# Altium schematic sheet Controller_Board.SchDoc: Controller Board - Power & CAN
size B; PageSetup: Record=PageOptions|CenterHorizontal=True|CenterVertical=True|PrintScale=0.64|XCorrection=1.00|YCorrection=1.00|PrintKind=1|BorderSize=5000000|LeftOffset=0|BottomOffset=0|Orientation=2|PaperLength=1000|PaperWidth=1000|Scale=100|PaperSource=7|PrintQuality=-3|MediaType=1|DitherType=10|PrintScaleMode=1|PaperKind=Letter|PaperIndex=1; Organization: Midnight Sun Solar Rayce Car Team; Address1: University of Waterloo; Address2: 200 University Ave W; Address3: Waterloo, ON, Canada; Address4: N2L 3E9; DocumentNumber: 3; SheetNumber: 3; SheetTotal: 3; Website: www.uwmidsun.com; ProjectName: ProjectName
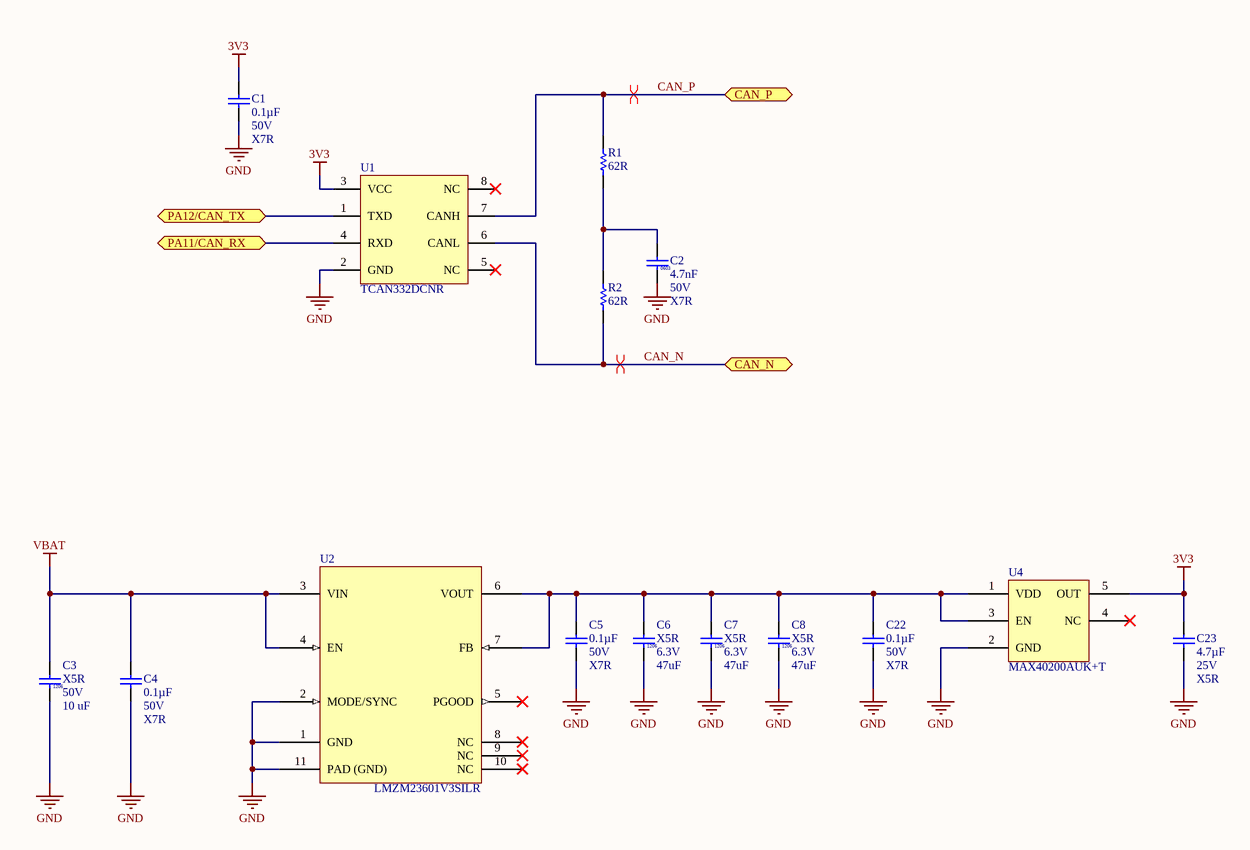
[diagram p0: Controller_Board.SchDoc]

## Parts
C1  Capacitance: 0.1µF  Voltage: 50V  Temperature Coefficient: X7R  [CAP, 0603]  (hidden comment: CAP CER 0.1UF 50V 10% X7R 0603)
C2  Capacitance: 4.7nF  Voltage: 50V  Dielectric: X7R  [CAP, 0603]  (hidden comment: CAP CER 4.7nF 50V 10% X7R 0603)
C3  Rating: X5R  Voltage Rating: 50V  Capacitance: 10 uF  [CAP, 1206]  (hidden comment: CAP CER 10uF 50V 20% X5R 1206)
C4  Capacitance: 0.1µF  Voltage: 50V  Temperature Coefficient: X7R  [CAP, 0603]  (hidden comment: CAP CER 0.1UF 50V 10% X7R 0603)
C5  Capacitance: 0.1µF  Voltage: 50V  Temperature Coefficient: X7R  [CAP, 0603]  (hidden comment: CAP CER 0.1UF 50V 10% X7R 0603)
C6  Dielectric: X5R  Voltage: 6.3V  Capacitance: 47uF  [CAP, 1206]  (hidden comment: CAP CER 47uF 6.3V X5R 1206)
C7  Dielectric: X5R  Voltage: 6.3V  Capacitance: 47uF  [CAP, 1206]  (hidden comment: CAP CER 47uF 6.3V X5R 1206)
C8  Dielectric: X5R  Voltage: 6.3V  Capacitance: 47uF  [CAP, 1206]  (hidden comment: CAP CER 47uF 6.3V X5R 1206)
C22  Capacitance: 0.1µF  Voltage: 50V  Temperature Coefficient: X7R  [CAP, 0603]  (hidden comment: CAP CER 0.1UF 50V 10% X7R 0603)
C23  Capacitance: 4.7µF  Voltage: 25V  Temperature Coefficient: X5R  [CAP, 0603]  (hidden comment: CAP CER 4.7UF 25V 10% X5R 0603)
R1  62R  [RES, 0603]
R2  62R  [RES, 0603]
U1  Manufacturer Part Number: TCAN332DCNR  [TSOP65P280X145-8N]  (hidden comment: IC CAN Tranceiver TCAN332DR)
U2  Manufacturer Part Number: LMZM23601V3SILR  [IC DCDC 3.3V 1A 10-uSIP]  (hidden comment: IC DC DC 3.3V 1A 10-uSIP)
U4  Manufacturer Part Number: MAX40200AUK+T  [SOT95P280X145-5N]  (hidden comment: IC IDEAL DIODE CURRENT SWITCH SOT23-5)

## Ports
CAN_N (bidir), CAN_P (bidir), PA11/CAN_RX (bidir), PA12/CAN_TX (bidir)

## Nets
3V3: C1.1 C23.1 U1.3(VCC) U4.5(OUT)
GND: C1.2 C2.2 C3.2 C4.2 C5.2 C6.2 C7.2 C8.2 C22.2 C23.2 U1.2(GND) U2.1(GND) U2.2(MODE/SYNC) U2.11(PAD_(GND)) U4.2(GND)
VBAT: C3.1 C4.1 U2.3(VIN) U2.4(EN)
CAN_N: R2.2 U1.6(CANL) ; port CAN_N
CAN_P: R1.1 U1.7(CANH) ; port CAN_P
PA11/CAN_RX: U1.4(RXD) ; port PA11/CAN_RX
PA12/CAN_TX: U1.1(TXD) ; port PA12/CAN_TX
NetC2_1: C2.1 R1.2 R2.1
NetC5_1: C5.1 C6.1 C7.1 C8.1 C22.1 U2.6(VOUT) U2.7(FB) U4.1(VDD) U4.3(EN)

Not connected (* = marked no-connect by the designer): U1 5(NC)* 8(NC)*; U2 5(PGOOD)* 8(NC)* 9(NC)* 10(NC)*; U4 4(NC)*

## Layout directives
differential pair: CAN_N, CAN_P

## Notes on the sheet
- PROJECT
- DOCUMENT
- DRAWN BY
- LAST MODIFIED
- PART NUMBER
- REVISION
- SHEET
- VARIANT
- OF
- Engineering 5 - 1002
  University of Waterloo
  (519) 888-4567 x32978
  hardware@uwmidsun.com

## Library data of the parts
C1 C4 C5 C22 = CAP CER 0.1UF 50V 10% X7R 0603: 0.10µF ±10% 50V Ceramic Capacitor X7R 0603 (1608 Metric); Manufacturer 1: AVX Corporation; Manufacturer Part Number 1: 06035C104KAT2A; Supplier 1: Digi-Key; Supplier Part Number 1: 478-5052-1-ND; Packaging: Cut Tape (CT); Part Status: Active; Operating Temperature: -55°C ~ 125°C; Ratings: -; Mounting Type: Surface Mount, MLCC; Package / Case: 0603 (1608 Metric); Size / Dimension: 0.063" L x 0.032" W (1.60mm x 0.81mm); Height - Seated (Max): -; Thickness (Max): 0.035" (0.90mm); Lead Spacing: -; Lead Style: -; ComponentLink1URL: http://datasheets.avx.com/X7RDielectric.pdf; ComponentLink1Description: http://datasheets.avx.com/X7RDielectric.pdf; Tolerance: ±10%
C2 = CAP CER 4.7nF 50V 10% X7R 0603: 4700pF ±10% 50V Ceramic Capacitor X7R 0603 (1608 Metric) /; Manufacturer: Murata; Manufacturer Part Number: GCM188R71H472KA37D; Supplier 1: Digi-Key; Supplier Part Number 1: 490-4932-1-ND; Packaging: Tape and Reel; Ratings: AEC-Q200; ComponentLink1URL: http://search.murata.co.jp/Ceramy/image/img/A01X/partnumbering_e_02.pdf?src-supplier=Digi-Key; ComponentLink1Description: http://search.murata.co.jp/Ceramy/image/img/A01X/partnumbering_e_02.pdf?src-supplier=Digi-Key; Tolerance: 10%; RoHS: Yes; Stock 1: 824762; Pricing 1: 1 = 0.21000, 10 = 0.15100, 100 = 0.07080, 500 = 0.04964, 1000 = 0.04109 (USD); Mount: Surface Mount; Case/Package: 0603; Weight: 7.1E-05oz; Case Code (Metric): 1608; Case Code (Imperial): 0603; Min Operating Temperature: -55°C; Max Operating Temperature: 125°C; Package Quantity: 1; Voltage Rating: 50V; Voltage Rating (DC): 50V; Termination: SMD/SMT; Length: 1.6mm; Height: 0.8mm; Width: 0.031inch; Thickness: 0.035inch; Depth: 0.8mm; Radiation Hardening: No; REACH SVHC: No SVHC; Lead Free: Lead Free; ComponentLink2URL: http://uk.rs-online.com/webdocs/0ef9/0900766b80ef92d0.pdf?src-supplier=RSComponents; ComponentLink2Description: http://uk.rs-online.com/webdocs/0ef9/0900766b80ef92d0.pdf?src-supplier=RSComponents; ComponentLink3URL: https://www.verical.com/server-webapp/html/getDatasheet?partID=223879&src-supplier=Verical; ComponentLink3Description: https://www.verical.com/server-webapp/html/getDatasheet?partID=223879&src-supplier=Verical; ComponentLink4URL: http://psearch.murata.com/capacitor/product/GCM188R71H472KA37%23.pdf?src-supplier=Avnet; ComponentLink4Description: http://psearch.murata.com/capacitor/product/GCM188R71H472KA37%23.pdf?src-supplier=Avnet
C3 = CAP CER 10uF 50V 20% X5R 1206: 10µF ±20% 50V Ceramic Capacitor X5R 1206 (3216 Metric) /; Manufacturer: Murata; Manufacturer Part Number: GRT31CR61H106ME01L; Supplier 1: Digi-Key; Supplier Part Number 1: 490-12457-1-ND; RoHS: Yes; Stock 1: 449467; Pricing 1: 1 = 0.57000, 10 = 0.39800, 100 = 0.23910, 500 = 0.17930, 1000 = 0.15141 (USD); Mount: Surface Mount; Case/Package: 1206; Case Code (Metric): 3216; Case Code (Imperial): 1206; Min Operating Temperature: -55°C; Max Operating Temperature: 85°C; Packaging: Tape and Reel; Tolerance: 20%; Length: 0.126inch; Width: 0.063inch; Thickness: 0.071inch; Ratings: AEC-Q200
C6-C8 = CAP CER 47uF 6.3V X5R 1206: 47µF ±20% 6.3V Ceramic Capacitor X5R 1206 (3216 Metric) /; Manufacturer: Samsung; Manufacturer Part Number: CL31A476MQHNNNE; Supplier 1: Digi-Key; Supplier Part Number 1: 1276-1167-1-ND; RoHS: Yes; Stock 1: 888566; Pricing 1: 1 = 0.44000, 10 = 0.30600, 100 = 0.18340, 500 = 0.13754, 1000 = 0.11614 (USD); Mount: Surface Mount; Case/Package: 1206; Case Code (Metric): 3216; Case Code (Imperial): 1206; Material: Ceramic; Contact Plating: Tin; Min Operating Temperature: -55°C; Max Operating Temperature: 85°C; Tolerance: 20%; Packaging: Tape and Reel; Package Quantity: 1; Voltage Rating: 6.3V; Length: 3.2mm; Height: 1.6mm; Width: 0.063inch; Thickness: 0.071inch; Depth: 1.6mm; Radiation Hardening: No; ComponentLink1URL: http://www.samsungsem.com/kr/support/product-search/mlcc/CL31A476MQHNNNE.jsp?src-supplier=Digi-Key; ComponentLink1Description: http://www.samsungsem.com/kr/support/product-search/mlcc/CL31A476MQHNNNE.jsp?src-supplier=Digi-Key; ComponentLink2URL: https://www.verical.com/server-webapp/html/getDatasheet?partID=358369&src-supplier=Verical; ComponentLink2Description: https://www.verical.com/server-webapp/html/getDatasheet?partID=358369&src-supplier=Verical; ComponentLink3URL: http://www1.futureelectronics.com/doc/SAMSUNG/CL31A476MQHNNNE.pdf?src-supplier=Future+Electronics; ComponentLink3Description: http://www1.futureelectronics.com/doc/SAMSUNG/CL31A476MQHNNNE.pdf?src-supplier=Future+Electronics; ComponentLink4URL: https://produktinfo.conrad.com/datenblaetter/450000-474999/452054-da-01-en-VS_KONDENSATOR_1206.pdf?src-supplier=Conrad; ComponentLink4Description: https://produktinfo.conrad.com/datenblaetter/450000-474999/452054-da-01-en-VS_KONDENSATOR_1206.pdf?src-supplier=Conrad
C23 = CAP CER 4.7UF 25V 10% X5R 0603: 4.7µF ±10% 25V Ceramic Capacitor X5R 0603 (1608 Metric); Manufacturer 1: Murata Electronics North America; Manufacturer Part Number 1: GRM188R61E475KE11D; Supplier 1: Digi-Key; Supplier Part Number 1: 490-7203-1-ND; Packaging: Cut Tape (CT); Part Status: Active; Operating Temperature: -55°C ~ 85°C; Ratings: -; Mounting Type: Surface Mount, MLCC; Package / Case: 0603 (1608 Metric); Size / Dimension: 0.063" L x 0.031" W (1.60mm x 0.80mm); Height - Seated (Max): -; Thickness (Max): 0.031" (0.80mm); Lead Spacing: -; Lead Style: -; ComponentLink1URL: http://www.murata.com/~/media/webrenewal/support/library/catalog/products/capacitor/mlcc/c02e.ashx; ComponentLink1Description: http://www.murata.com/~/media/webrenewal/support/library/catalog/products/capacitor/mlcc/c02e.ashx; Tolerance: ±10%
R1 R2 = RES 62 OHM 0.1% 1/10W 0603: 62 Ohms ±0.1% 0.1W, 1/10W Chip Resistor 0603 (1608 Metric) Automotive AEC-Q200 Thin Film; Manufacturer: Panasonic Electronic Components; Manufacturer Part Number: ERA-3AEB620V; Temperature Coefficient: ±25ppm/°C; Value: 62; Supplier 1: Digi-Key; RoHS: RoHS Compliant; Category: Resistors; Stock 1: 10320; Pricing 1: 1=0.52, 10=0.447, 100=0.1748, 1000=0.07317, 2500=0.06708 (CAD); Packaging: Cut Tape (CT); Part Status: Active; Tolerance: ±0.1%; Power (Watts): 0.1W, 1/10W; Composition: Thin Film; Features: Automotive AEC-Q200; Operating Temperature: -55°C ~ 155°C; Package / Case: 0603 (1608 Metric); Supplier Device Package: 0603; Size / Dimension: 0.063" L x 0.032" W (1.60mm x 0.80mm); Height - Seated (Max): 0.022" (0.55mm); Failure Rate: -; ComponentLink1URL: https://industrial.panasonic.com/cdbs/www-data/pdf/RDM0000/AOA0000C307.pdf; ComponentLink1Description: https://industrial.panasonic.com/cdbs/www-data/pdf/RDM0000/AOA0000C307.pdf; Supplier Part Number 1: P62DBCT-ND
U1 = IC CAN Tranceiver TCAN332DR: 1/1 Transceiver CANbus SOT-23-8; Manufacturer: Texas Instruments; Supplier 1: Digi-Key; Supplier Part Number 1: 296-47355-1-ND; Stock 1: 2387; Pricing 1: 1 = 2.27000, 10 = 2.04200, 100 = 1.64100, 500 = 1.34828, 1000 = 1.11714 (USD); Min Operating Temperature: -40°C; Max Operating Temperature: 125°C; Lead Free: Lead Free
U2 = IC DC DC 3.3V 1A 10-uSIP: Non-Isolated PoL Module DC DC Converter 1 Output 3.3V 1A 4V - 36V Input; Manufacturer: Texas Instruments; Supplier 1: Digi-Key; Supplier Part Number 1: 296-51381-1-ND; Stock 1: 1291; Pricing 1: 1 = 5.76000, 10 = 5.17700, 100 = 4.24200, 500 = 3.61110, 1000 = 3.04550 (USD); Min Operating Temperature: -40°C; Max Operating Temperature: 125°C; ComponentLink1Description: Datasheet; ComponentLink1URL: http://www.ti.com/lit/ds/symlink/lmzm23601.pdf
U4 = IC IDEAL DIODE CURRENT SWITCH SOT23-5: OR Controller Source Selector Switch P-Channel 1:1 SOT-23-5; Manufacturer: Maxim; Supplier 1: Digi-Key; Supplier Part Number 1: MAX40200AUK+TCT-ND; Stock 1: 7780; Pricing 1: 1 = 0.93000, 10 = 0.82100, 100 = 0.62930, 500 = 0.49750, 1000 = 0.39799 (USD); ComponentLink1Description: Datasheet; ComponentLink1URL: https://datasheets.maximintegrated.com/en/ds/MAX40200.pdf